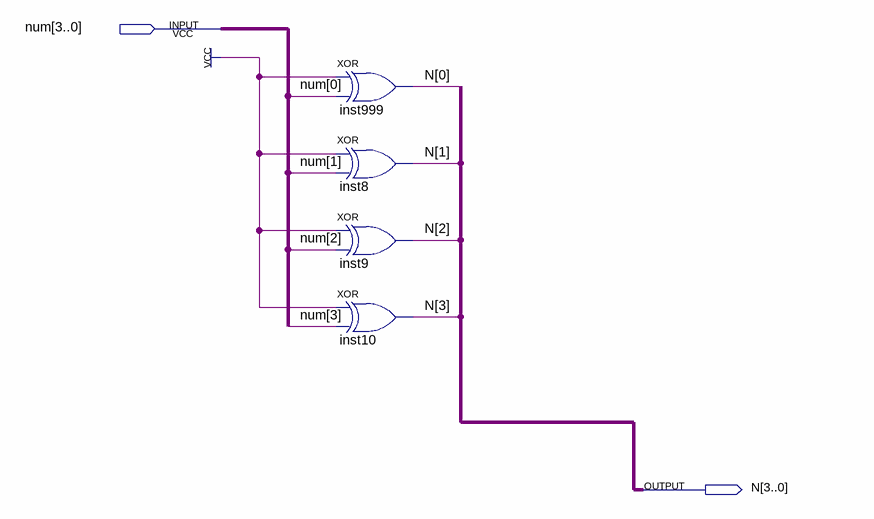
[diagram p0: schematic sheet]
// Quartus schematic inv.bdf as structural Verilog: 4 symbols, 2 pins
module inv (
  input  [3:0] num,
  output [3:0] N
);

  xor inst999 (N[0], 1'b1, num[0]);
  xor inst8 (N[1], 1'b1, num[1]);
  xor inst9 (N[2], 1'b1, num[2]);
  xor inst10 (N[3], 1'b1, num[3]);
endmodule
